# EAGLE design ION-KB RGB LED (EAGLE 6.5.0)
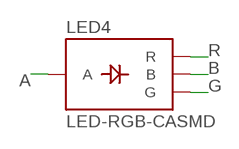
[diagram p0: schematic, sheet 1]

## Parts
LED4  LED-RGB-CASMD  [LED-SMD-RGB]

## Nets
A: LED4.A
B: LED4.B
G: LED4.G
R: LED4.R

## Library data of the parts
LED4 = Jordi:LED-RGB-CA: RGB LED

## Board
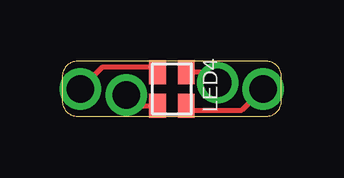
[diagram p1: board, top side]

Size 9.14 x 2.29 mm. Coordinates in mm from the lower left corner, seen from the top.
Outline: 0,1.65 0,0.64 arc90 0.64,0 8.51,0 arc90 9.14,0.64 9.14,1.65 arc90 8.51,2.29 0.64,2.29 arc90 0,1.65
Copper layers (1*16): Top 0.035mm / dielectric 1.5mm / Bottom 0.035mm
Design rules "default": minimum track width 10mil, minimum drill 24mil, track to track 8mil, track to pad 8mil, pad to pad 8mil, via to via 8mil, smd to smd 8mil, copper to edge 40mil, drill to drill 8mil, minimum pad ring 10mil, minimum via ring 8mil, stop-mask expansion 4mil, vias tented up to drill 0mil, thermal gap 10mil

### Footprints (pad centres in the part's own frame; a part is rotated, then mirrored left to right if it is on the bottom)
LED-SMD-RGB = smd 1 x 0.7: A 0.7,-0.6; B 0.7,0.6; G -0.7,-0.6; R -0.7,0.6

### Placement (x,y rotation side)
LED4  4.57,1.14 270 top

### Tracks (layer width: path | path; a pad name or v marks a point on that pad's centre or on a via)
A  (via drill 1.15 pad 1.27)
  Top 0.203: v2.67,0.89 3.11,0.44 LED4.A
B  (via drill 1.15 pad 1.27)
  Top 0.203: LED4.B 5.36,0.25 7.49,0.25 v8.38,1.14
G  (via drill 1.15 pad 1.27)
  Top 0.203: LED4.G 3.78,2.03 1.65,2.03 v0.76,1.14
R  (via drill 1.15 pad 1.27)
  Top 0.203: v6.48,1.4 6.03,1.84 LED4.R